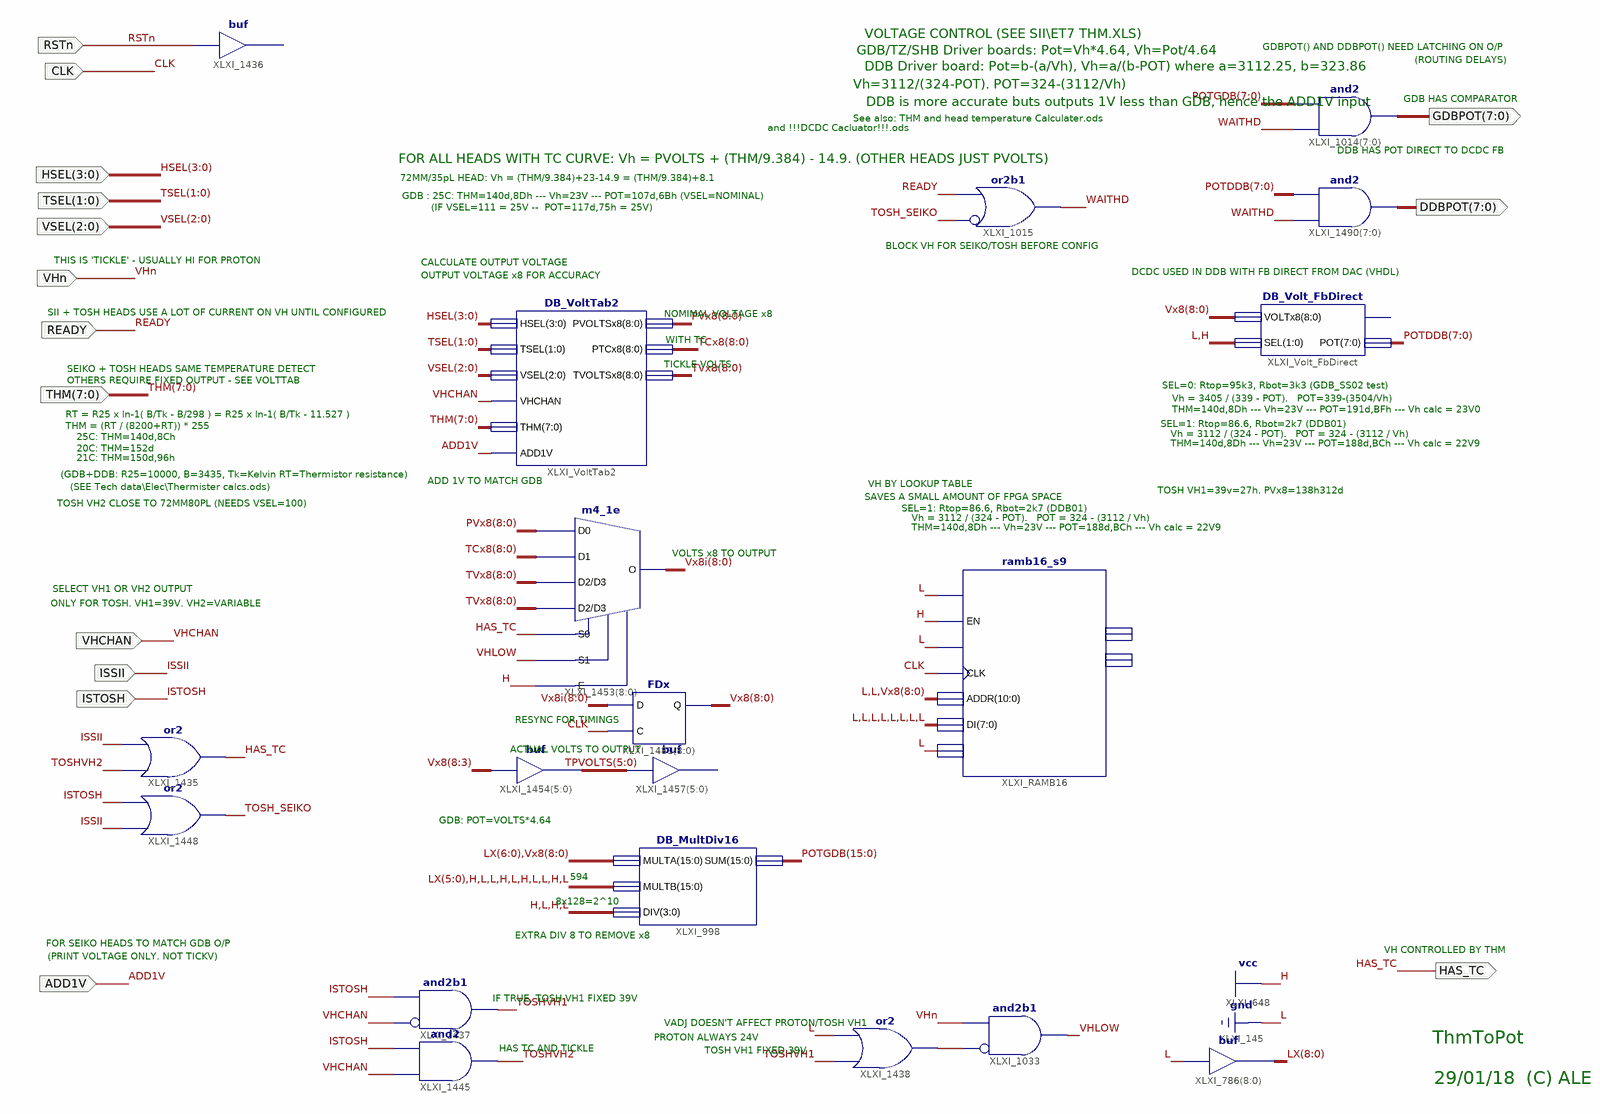
[diagram p0: schematic sheet 1]
// Xilinx ISE schematic DB_ThmToPot.sch (spartan3e) as structural Verilog: 19 symbols, 15 ports
module DB_ThmToPot (
  input  CLK,
  input  RSTn,
  input  [2:0] VSEL,
  input  [1:0] TSEL,
  input  VHn,
  input  READY,
  input  [3:0] HSEL,
  input  [7:0] THM,
  input  VHCHAN,
  input  ISTOSH,
  input  ISSII,
  input  ADD1V,
  output HAS_TC,
  output [7:0] GDBPOT,
  output [7:0] DDBPOT
);

  wire TOSH_SEIKO, TOSHVH1, TOSHVH2, VHLOW, WAITHD, XLXN_37;
  wire [5:0] TPVOLTS;
  wire [7:0] POTDDB;
  wire [8:0] LX, PVx8, TCx8, TVx8, Vx8, Vx8i;
  wire [15:0] POTGDB;

  // buf XLXI_1436 has open pins: I=RSTn, O=open
  assign LX = {9{1'b0}};  // buf XLXI_786[8..0], 9 bits wide
  or XLXI_1015 (WAITHD, ~TOSH_SEIKO, READY);  // or2b1
  and XLXI_1437 (TOSHVH1, ~VHCHAN, ISTOSH);  // and2b1
  and XLXI_1445 (TOSHVH2, VHCHAN, ISTOSH);
  and XLXI_1033 (VHLOW, ~XLXN_37, VHn);  // and2b1
  or XLXI_1438 (XLXN_37, TOSHVH1, 1'b0);
  or XLXI_1448 (TOSH_SEIKO, ISSII, ISTOSH);
  or XLXI_1435 (HAS_TC, TOSHVH2, ISSII);
  DB_MultDiv16 XLXI_998 (.DIV(4'b1010), .MULTA({LX[6:0], Vx8}), .MULTB({LX[5:0], 10'b1001010010}), .SUM(POTGDB));
  m4_1e XLXI_1453[8:0] (.D0(PVx8), .D1(TCx8), .D2(TVx8), .D3(TVx8), .E(1'b1), .S0(HAS_TC), .S1(VHLOW), .O(Vx8i));
  assign TPVOLTS = Vx8[8:3];  // buf XLXI_1454[5..0], 6 bits wide
  // buf XLXI_1457[5..0] has open pins: I=TPVOLTS, O=open
  FDx XLXI_1481[8:0] (.C(CLK), .D(Vx8i), .Q(Vx8));
  DB_VoltTab2 XLXI_VoltTab2 (
    .ADD1V(ADD1V), .HSEL(HSEL), .PTCx8(TCx8), .PVOLTSx8(PVx8), .THM(THM), .TSEL(TSEL), .TVOLTSx8(TVx8),
    .VHCHAN(VHCHAN), .VSEL(VSEL));
  ramb16_s9 #(.INIT_02("3E3B3835322F2C2926221F1B1814100D09050100000000000000000000000000"), .INIT_03("807E7D7B7978767473716F6D6B69686664625F5D5B59575452504D4B48464341"), .INIT_04("A7A6A5A4A3A2A1A09F9E9D9C9A99989796959392918F8E8D8B8A898786848381"), .INIT_05("C2C1C0BFBFBEBDBDBCBBBABAB9B8B7B6B6B5B4B3B2B1B1B0AFAEADACABAAA9A8"), .INIT_06("D4D4D3D3D2D2D1D1D0D0CFCECECDCDCCCCCBCACAC9C9C8C7C7C6C5C5C4C4C3C2"), .INIT_07("E2E2E1E1E1E0E0DFDFDFDEDEDDDDDDDCDCDBDBDADAD9D9D9D8D8D7D7D6D6D5D5"), .INIT_08("EDEDECECECECEBEBEBEAEAEAE9E9E9E8E8E8E7E7E7E6E6E6E5E5E4E4E4E3E3E3"), .INIT_09("F6F6F5F5F5F5F4F4F4F4F3F3F3F2F2F2F2F1F1F1F1F0F0F0EFEFEFEFEEEEEEED"), .INIT_0A("F7F7F7F7F7F7F7F7F7F7F7F7F7F7F7F7F7F7F7F7F7F7F7F7F7F7F7F7F7F7F6F6"), .INIT_0B("F7F7F7F7F7F7F7F7F7F7F7F7F7F7F7F7F7F7F7F7F7F7F7F7F7F7F7F7F7F7F7F7"), .INIT_0C("F7F7F7F7F7F7F7F7F7F7F7F7F7F7F7F7F7F7F7F7F7F7F7F7F7F7F7F7F7F7F7F7"), .INIT_0D("F7F7F7F7F7F7F7F7F7F7F7F7F7F7F7F7F7F7F7F7F7F7F7F7F7F7F7F7F7F7F7F7"), .INIT_0E("F7F7F7F7F7F7F7F7F7F7F7F7F7F7F7F7F7F7F7F7F7F7F7F7F7F7F7F7F7F7F7F7"), .INIT_0F("F7F7F7F7F7F7F7F7F7F7F7F7F7F7F7F7F7F7F7F7F7F7F7F7F7F7F7F7F7F7F7F7")) XLXI_RAMB16 (
    .ADDR({2'b00, Vx8}), .CLK(CLK), .DI({8{1'b0}}), .DIP(1'b0), .EN(1'b1), .SSR(1'b0), .WE(1'b0));  // open: DO, DOP
  assign GDBPOT = {8{WAITHD}} & POTGDB[7:0];  // and2 XLXI_1014[7..0], 8 bits wide
  assign DDBPOT = {8{WAITHD}} & POTDDB;  // and2 XLXI_1490[7..0], 8 bits wide
  DB_Volt_FbDirect XLXI_Volt_FbDirect (.VOLTx8(Vx8), .SEL(2'b01), .POT(POTDDB));  // open: OFL

  // Notes on the sheet:
  //   VOLTAGE CONTROL (SEE SII\ET7 THM.XLS)
  //   GDBPOT() AND DDBPOT() NEED LATCHING ON O/P
  //   GDB/TZ/SHB Driver boards: Pot=Vh*4.64, Vh=Pot/4.64
  //   (ROUTING DELAYS)
  //   DDB Driver board: Pot=b-(a/Vh), Vh=a/(b-POT) where a=3112.25, b=323.86
  //   Vh=3112/(324-POT). POT=324-(3112/Vh)
  //   GDB HAS COMPARATOR
  //   DDB is more accurate buts outputs 1V less than GDB, hence the ADD1V input
  //   See also: THM and head temperature Calculater.ods
  //   and !!!DCDC Cacluator!!!.ods
  //   DDB HAS POT DIRECT TO DCDC FB
  //   FOR ALL HEADS WITH TC CURVE: Vh = PVOLTS + (THM/9.384) - 14.9. (OTHER HEADS JUST PVOLTS)
  //   72MM/35pL HEAD: Vh = (THM/9.384)+23-14.9 = (THM/9.384)+8.1
  //   GDB : 25C: THM=140d,8Dh --- Vh=23V --- POT=107d,6Bh (VSEL=NOMINAL)
  //   (IF VSEL=111 = 25V --  POT=117d,75h = 25V)
  //   BLOCK VH FOR SEIKO/TOSH BEFORE CONFIG
  //   THIS IS 'TICKLE' - USUALLY HI FOR PROTON
  //   CALCULATE OUTPUT VOLTAGE
  //   DCDC USED IN DDB WITH FB DIRECT FROM DAC (VHDL)
  //   OUTPUT VOLTAGE x8 FOR ACCURACY
  //   SII + TOSH HEADS USE A LOT OF CURRENT ON VH UNTIL CONFIGURED
  //   NOMIMAL VOLTAGE x8
  //   WITH TC
  //   TICKLE VOLTS
  //   SEIKO + TOSH HEADS SAME TEMPERATURE DETECT
  //   OTHERS REQUIRE FIXED OUTPUT - SEE VOLTTAB
  //   SEL=0: Rtop=95k3, Rbot=3k3 (GDB_SS02 test)
  //   Vh = 3405 / (339 - POT).   POT=339-(3504/Vh)
  //   THM=140d,8Dh --- Vh=23V --- POT=191d,BFh --- Vh calc = 23V0
  //   RT = R25 x ln-1( B/Tk - B/298 ) = R25 x ln-1( B/Tk - 11.527 )
  //   SEL=1: Rtop=86.6, Rbot=2k7 (DDB01)
  //   THM = (RT / (8200+RT)) * 255
  //   Vh = 3112 / (324 - POT).   POT = 324 - (3112 / Vh)
  //   25C: THM=140d,8Ch
  //   THM=140d,8Dh --- Vh=23V --- POT=188d,BCh --- Vh calc = 22V9
  //   20C: THM=152d
  //   21C: THM=150d,96h
  //   (GDB+DDB: R25=10000, B=3435, Tk=Kelvin RT=Thermistor resistance)
  //   ADD 1V TO MATCH GDB
  //   VH BY LOOKUP TABLE
  //   (SEE Tech data\Elec\Thermister calcs.ods)
  //   TOSH VH1=39v=27h. PVx8=138h312d
  //   SAVES A SMALL AMOUNT OF FPGA SPACE
  //   TOSH VH2 CLOSE TO 72MM80PL (NEEDS VSEL=100)
  //   SEL=1: Rtop=86.6, Rbot=2k7 (DDB01)
  //   Vh = 3112 / (324 - POT).   POT = 324 - (3112 / Vh)
  //   THM=140d,8Dh --- Vh=23V --- POT=188d,BCh --- Vh calc = 22V9
  //   VOLTS x8 TO OUTPUT
  //   SELECT VH1 OR VH2 OUTPUT
  //   ONLY FOR TOSH. VH1=39V. VH2=VARIABLE
  //   RESYNC FOR TIMINGS
  //   ACTUAL VOLTS TO OUTPUT
  //   GDB: POT=VOLTS*4.64
  //   594
  //   8x128=2^10
  //   EXTRA DIV 8 TO REMOVE x8
  //   FOR SEIKO HEADS TO MATCH GDB O/P
  //   VH CONTROLLED BY THM
  //   (PRINT VOLTAGE ONLY. NOT TICKV)
  //   IF TRUE, TOSH VH1 FIXED 39V
  //   VADJ DOESN'T AFFECT PROTON/TOSH VH1
  //   PROTON ALWAYS 24V
  //   ThmToPot
  //   HAS TC AND TICKLE
  //   TOSH VH1 FIXED 39V
  //   29/01/18  (C) ALE
endmodule
